# EAGLE design ATTint_SOMO-4D (EAGLE 6.1)
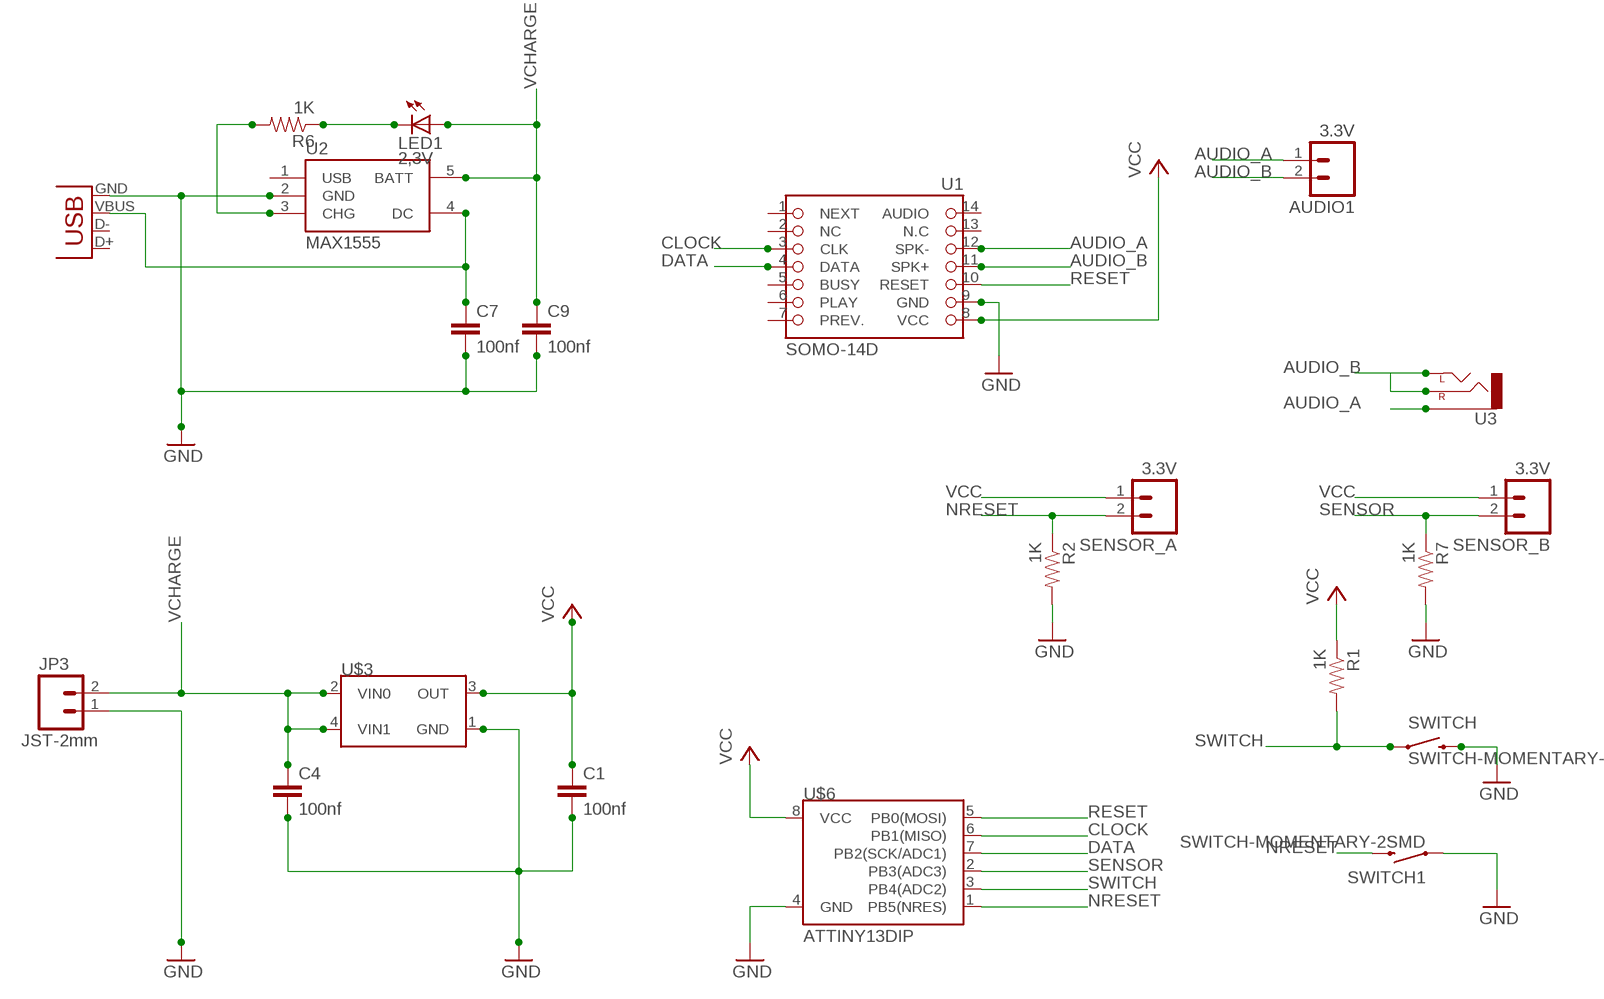
[diagram p0: schematic, sheet 1]

## Parts
AUDIO1  3.3V  M02LOCK_LONGPADS  [1X02_LOCK_LONGPADS]
C1  100nf  CAP0805  [0805]
C4  100nf  CAP0805  [0805]
C7  100nf  CAP0805  [0805]
C9  100nf  CAP0805  [0805]
JP3  JST-2mm  M02-JST-2MM-SMT  [JST-2-SMD]
LED1  2,3V  LEDCHIP-LED0805  [CHIP-LED0805]
R1  1K  RESISTOR  [0805]
R2  1K  RESISTOR  [0805]
R6  1K  RESISTOR  [0805]
R7  1K  RESISTOR  [0805]
SENSOR_A  3.3V  M02LOCK_LONGPADS  [1X02_LOCK_LONGPADS]
SENSOR_B  3.3V  M02LOCK_LONGPADS  [1X02_LOCK_LONGPADS]
SWITCH  SWITCH-MOMENTARY-2  [TACTILE_SWITCH_TALL]
SWITCH1  SWITCH-MOMENTARY-2SMD  [TACTILE_SWITCH_SMD]
U1  SOMO-14D  [SOMO-14D]
U2  MAX1555  [SOT23-5]
U3  AUDIO-JACKSMD2  [AUDIO-JACK-3.5MM-SMD]
U$3  MCP1703  [SOT-89]
U$6  ATTINY13DIP  [DIP08]
X3  USB-SMD-NS  [USB-MINIB-NOSTOP]

## Nets
AUDIO_A: AUDIO1.1 U1.12(SPK-) U3.SLEEVE
AUDIO_B: AUDIO1.2 U1.11(SPK+) U3.RING(RIGHT) U3.TIP(LEFT)
CLOCK: U1.3(CLK) U$6.6(PB1(MISO))
DATA: U1.4(DATA) U$6.7(PB2(SCK/ADC1))
GND [gnd_plane]: C1.2 C4.2 C7.2 C9.2 JP3.1 R2.2 R7.2 SWITCH1.1 SWITCH.B2 U1.9(GND) U2.2(GND) U$3.1(GND) U$6.4(GND) X3.GND
N$6: C7.1 U2.4(DC) X3.VBUS
N$7: R6.2 U2.3(CHG)
N$8: LED1.C R6.1
NRESET: R2.1 SENSOR_A.2 SWITCH1.3 U$6.1(PB5(NRES))
RESET: U1.10(RESET) U$6.5(PB0(MOSI))
SENSOR: R7.1 SENSOR_B.2 U$6.2(PB3(ADC3))
SWITCH: R1.2 SWITCH.A2 U$6.3(PB4(ADC2))
VCC [power]: C1.1 R1.1 SENSOR_A.1 SENSOR_B.1 U1.8(VCC) U$3.3(OUT) U$6.8(VCC)
VCHARGE [VDD]: C4.1 C9.1 JP3.2 LED1.A U2.5(BATT) U$3.2(VIN0) U$3.4(VIN1)
Unconnected: U1.1(NEXT) U1.2(NC) U1.5(BUSY) U1.6(PLAY) U1.7(PREV.) U1.13(N.C) U1.14(AUDIO) U2.1(USB) X3.D+ X3.D-

## Library data of the parts
AUDIO1 JP3 = SparkFun:M02: Header 2 Standard 2-pin 0.1" header. Use with straight break away headers (SKU : PRT-00116), right angle break away headers (PRT-00553), swiss pins (PRT-00743), machine pins (PRT-00117), and female headers (PRT-00115). Molex polarized connector foot print use with SKU : PRT-08233 with associated crimp pins and housings.
C1 C4 C7 C9 = spark-fun:CAP: Capacitor Standard 0603 ceramic capacitor, and 0.1" leaded capacitor.
LED1 = led:LED: LED OSRAM: - CHIPLED LG R971, LG N971, LY N971, LG Q971, LY Q971, LO R971, LY R971 LH N974, LH R974 LS Q976, LO Q976, LY Q976 LO Q996 - Hyper CHIPLED LW Q18S LB Q993, LB Q99A, LB R99A - SideLED LS A670, LO A670, LY A670, LG A670, LP A670 LB A673, LV A673, LT A673, LW A673 LH A674 LY A675 LS A676, LA A676, LO A676, LY A676, LW A676 LS A679, LY A679, LG A679 - Hyper Micro SIDELED® LS Y876, LA Y876, LO Y876, LY Y876 LT Y87S - SmartLED LW L88C, LW L88S LB L89C, LB L89S, LG L890 LS L89K, LO L89K, LY L89K LS L896, LA L896, LO L896, LY L896 - TOPLED LS T670, LO T670, LY T670, LG T670, LP T670 LSG T670, LSP T670, LSY T670, LOP T670, LYG T670 LG T671, LOG T671, LSG T671 LB T673, LV T673, LT T673, LW T673 LH T674 LS T676, LA T676, LO T676, LY T676, LB T676, LH T676, LSB T676, LW T676 LB T67C, LV T67C, LT T67C, LS T67K, LO T67K, LY T67K, LW E67C LS E67B, LA E67B, LO E67B, LY E67B, LB E67C, LV E67C, LT E67C LW T67C LS T679, LY T679, LG T679 LS T770, LO T770, LY T770, LG T770, LP T770 LB T773, LV T773, LT T773, LW T773 LH T774 LS E675, LA E675, LY E675, LS T675 LS T776, LA T776, LO T776, LY T776, LB T776 LHGB T686 LT T68C, LB T68C - Hyper Mini TOPLED® LB M676 - Mini TOPLED Santana® LG M470 LS M47K, LO M47K, LY M47K Source: http://www.osram.convergy.de LUXEON: - LUMILED® LXK2-PW12-R00, LXK2-PW12-S00, LXK2-PW14-U00, LXK2-PW14-V00 LXK2-PM12-R00, LXK2-PM12-S00, LXK2-PM14-U00 LXK2-PE12-Q00, LXK2-PE12-R00, LXK2-PE12-S00, LXK2-PE14-T00, LXK2-PE14-U00 LXK2-PB12-K00, LXK2-PB12-L00, LXK2-PB12-M00, LXK2-PB14-N00, LXK2-PB14-P00, LXK2-PB14-Q00 LXK2-PR12-L00, LXK2-PR12-M00, LXK2-PR14-Q00, LXK2-PR14-R00 LXK2-PD12-Q00, LXK2-PD12-R00, LXK2-PD12-S00 LXK2-PH12-R00, LXK2-PH12-S00 LXK2-PL12-P00, LXK2-PL12-Q00, LXK2-PL12-R00 Source: www.luxeon.com KINGBRIGHT: KA-3528ASYC Source: www.kingbright.com
R1 R2 R6 R7 = spark-fun:RESISTOR: Resistor Basic schematic elements and footprints for 0603, 1206, and PTH 1/10th watt (small) resistors.
SENSOR_A SENSOR_B = charles:M02: Header 2 Standard 2-pin 0.1" header. Use with straight break away headers (SKU : PRT-00116), right angle break away headers (PRT-00553), swiss pins (PRT-00743), machine pins (PRT-00117), and female headers (PRT-00115). Molex polarized connector foot print use with SKU : PRT-08233 with associated crimp pins and housings.
SWITCH SWITCH1 = SparkFun:SWITCH-MOMENTARY-2
U1 = SpaElectronics:SOMO-14D: SOMO-14D This library allows the mounting of the SOMO-14D to a circuit board, either via female headers (Recomended), or direct soldering (Not Recomended). http://www.4dsystems.com.au/prod.php?id=73
U2 = spark-fun:MAX1555: MAX1555 Lithium Charger IC SOT-23 Lithium Polymer charging IC. Schematic element and footprint proven. Spark Fun Electronics SKU : COM-00674
U3 = SparkFun:AUDIO-JACK: 3.5mm Audio Jack Simple 3.5mm common PCB mount audio jack. SKU: PRT-08032
U$3 = MCP1703:MCP1703
U$6 = SparkFun:ATTINY13
X3 = SparkFun:USB: USB Connectors USB-B-PTH is fully proven SKU : PRT-00139 USB-miniB is fully proven SKU : PRT-00587 USB-A-PCB is untested. USB-A-H is throughly reviewed, but untested. Spark Fun Electronics SKU : PRT-00437 USB-B-SMT is throughly reviewed, but untested. Needs silkscreen touching up. USB-A-S has not been used/tested USB-MB-H has not been used/tested

## Net classes
1 power: width 0.203 mm
2 gnd_plane: width 2 mm, drill 0.8 mm, clearance 0.432 mm
4 VDD: width 1 mm, clearance 0.381 mm

## Board
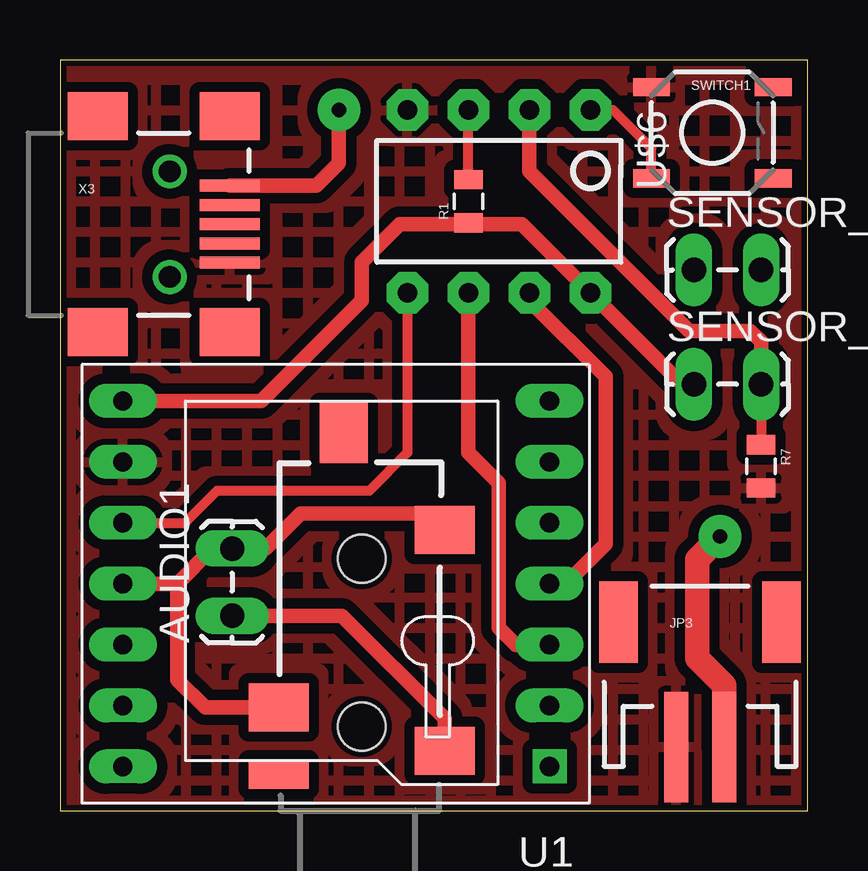
[diagram p1: board, top side]
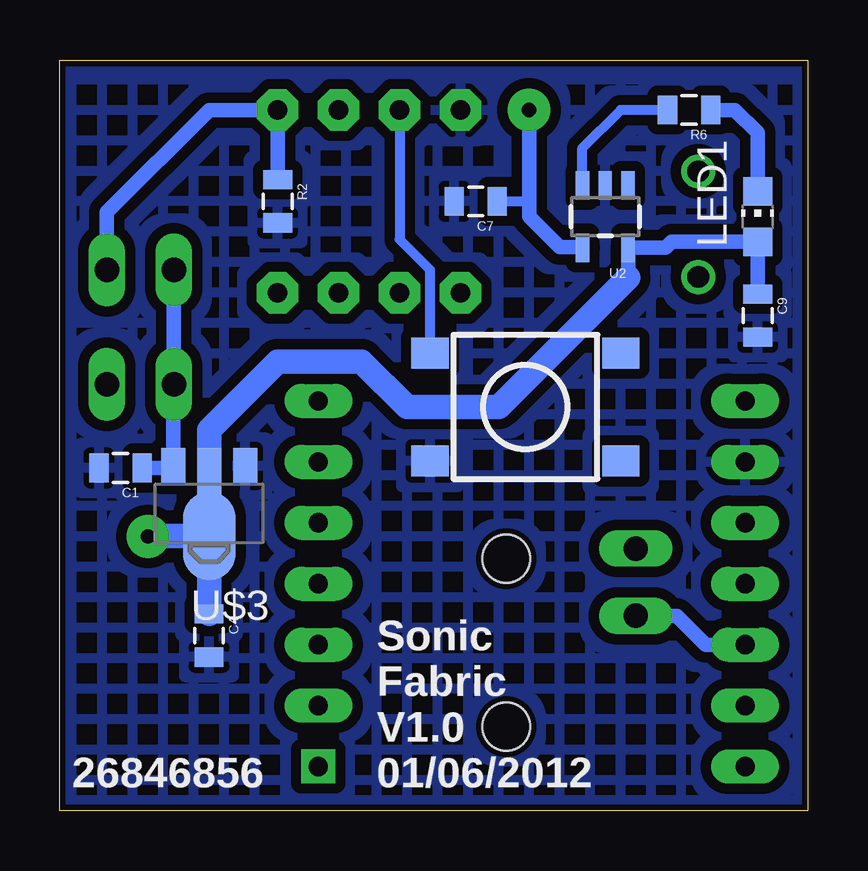
[diagram p2: board, bottom side, seen from below]

Size 31.17 x 31.3 mm. Coordinates in mm from the lower left corner, seen from the top.
Outline: 0,0 31.17,0 31.17,31.3 0,31.3 0,0
Copper layers (1*16): Top 0.035mm / dielectric 1.5mm / Bottom 0.035mm
Design rules: minimum track width 6mil, minimum drill 12mil, track to track 6mil, track to pad 6mil, pad to pad 6mil, via to via 6mil, smd to smd 0mil, copper to edge 10mil, drill to drill 10mil, minimum pad ring 10mil, minimum via ring 6mil, stop-mask expansion 2mil, vias tented up to drill 100mil, thermal gap 10mil

### Footprints (pad centres in the part's own frame; a part is rotated, then mirrored left to right if it is on the bottom)
1X02_LOCK_LONGPADS = drill 1.016 long: 1 -0.127,0; 2 2.667,0
0805 = smd 0.8 x 1.2: 1 -0.9,0; 2 0.9,0
JST-2-SMD = smd 1 x 4.6: 1 -1,-3.7; 2 1,-3.7 | smd 1.6 x 3.4: NC1 -3.4,1.5; NC2 3.4,1.5
CHIP-LED0805 = smd 1.2 x 1.2: A 0,-1.05; C 0,1.05
TACTILE_SWITCH_TALL = smd 1.55 x 1.3: A1 -3.975,-2.25; A2 3.975,-2.25; B1 -3.975,2.25; B2 3.975,2.25
TACTILE_SWITCH_SMD = smd 1.524 x 0.762: 1 -2.54,1.905; 2 2.54,1.905; 3 -2.54,-1.905; 4 2.54,-1.905
SOMO-14D = drill 0.8 pad 1.422 square: 1 -9.16,7.24 | drill 0.8 pad 1.422 long: 2 -9.16,4.7; 3 -9.16,2.16; 4 -9.16,-0.38; 5 -9.16,-2.92; 6 -9.16,-5.46; 7 -9.16,-8; 8 8.62,-8; 9 8.62,-5.46; 10 8.62,-2.92; 11 8.62,-0.38; 12 8.62,2.16; 13 8.62,4.7; 14 8.62,7.24
SOT23-5 = smd 0.55 x 1.2: 1 -0.95,-1.3; 2 0,-1.3; 3 0.95,-1.3; 4 0.95,1.3; 5 -0.95,1.3
AUDIO-JACK-3.5MM-SMD = smd 2 x 2.5: RING 4.3,3.45; SLEEVE 2.5,-3.45; TIP 11.7,-3.45 | smd 1.2 x 2.5: RSH 1.5,3.45 | smd 2.5 x 2: TSH 15.75,0.75 | hole 2: 3.5,0; 10.5,0
SOT-89 = smd 1 x 1.5: 1 -1.499,-1.981; 3 1.499,-1.981 | smd 1 x 2: 2 0,-1.727 | smd 2.2 x 3.7: 4 0,0.94
DIP08 = drill 0.813 pad 1.727 octagon: 1 -3.81,-3.81; 2 -1.27,-3.81; 3 1.27,-3.81; 4 3.81,-3.81; 5 3.81,3.81; 6 1.27,3.81; 7 -1.27,3.81; 8 -3.81,3.81
USB-MINIB-NOSTOP = smd 2.5 x 0.5: D+ 2.5,0; D- 2.5,0.8; GND 2.5,-1.6; ID 2.5,-0.8; VBUS 2.5,1.6 | smd 2.5 x 2: G1 -3,-4.5; G2 -3,4.5; G3 2.5,4.5; G4 2.5,-4.5 | drill 0.9 pad 0.8: H1 0,2.2 | drill 0.9 pad 0.787: H2 0,-2.2

### Placement (x,y rotation side)
AUDIO1  7.18,8.26 90 top
C1  28.64,14.29 180 bottom
C4  24.96,7.3 270 bottom
C7  13.84,25.4 180 bottom
C9  2.1,20.64 270 bottom
JP3  26.67,6.35 0 top
LED1  2.1,24.77 0 bottom
R1  17.02,25.4 90 top
R2  22.1,25.4 270 bottom
R6  4.95,29.21 180 bottom
R7  29.21,14.35 270 top
SENSOR_A  26.54,22.54 0 top
SENSOR_B  26.54,17.78 0 top
SWITCH  11.77,16.83 180 bottom
SWITCH1  27.18,28.26 0 top
U1  11.24,9.08 180 top
U2  8.45,24.77 180 bottom
U3  12.57,0 90 top
U$3  24.96,12.38 180 bottom
U$6  18.29,25.4 180 top
X3  4.57,24.45 0 top

### Tracks (layer width: path | path; a pad name or v marks a point on that pad's centre or on a via)
AUDIO_A
  Top 0.61: AUDIO1.1 11.75,8.13 16.02,3.85 U3.SLEEVE
  Bottom 0.61: AUDIO1.1 5.46,8.13 4.25,6.92 U1.12
AUDIO_B
  Top 0.61: U1.11 4.89,9.46 | U3.TIP 15.34,12.38 10.03,12.38 8.57,10.92 AUDIO1.2 6.35,10.92 4.89,9.46 | 4.89,9.46 4.89,5.46 6.05,4.3 U3.RING
CLOCK
  Top 0.61: U$6.6 17.02,14.92 18.29,13.65 18.29,7.62 18.99,6.92 U1.3
DATA
  Top 0.61: U$6.7 19.56,21.27 22.73,18.1 22.73,11.11 21.08,9.46 U1.4
GND
  pour Bottom (hatched): 0,31.31 31.18,31.31 31.18,0 0,0
  pour Top (hatched): 0,31.31 31.18,31.31 31.18,0 0,0
N$6  (via drill 0.6 pad 1.78)
  Top 0.61: X3.VBUS 10.68,26.05 11.62,26.99 v11.62,29.21
  Bottom 0.406: C7.1 11.62,25.4
  Bottom 0.61: v11.62,29.21 11.62,25.4 11.62,24.77 10.35,23.5 9.43,23.5 U2.4
N$7
  Bottom 0.406: U2.3 9.4,27.62 7.81,29.21 R6.2
N$8
  Bottom 0.61: R6.1 3.05,29.21 2.1,28.26 LED1.C
NRESET
  Top 0.406: U$6.1 23.05,29.21 24.64,27.62 SWITCH1.3
  Bottom 0.61: SENSOR_A.2 29.21,24.96 24.96,29.21 U$6.1 R2.1
RESET
  Top 0.406: U$6.5 14.48,14.92 12.89,13.34 6.54,13.34 5.21,12 U1.10
SENSOR
  Top 0.406: SENSOR_B.2 R7.1
  Top 0.61: SENSOR_B.2 29.21,19.56 28.77,20 26.23,20 19.56,26.67 U$6.2
SWITCH
  Top 0.406: R1.2 U$6.3
  Bottom 0.406: U$6.3 17.02,23.81 15.75,22.54 SWITCH.A2
VCC
  Top 0.406: R1.1 16.75,24.5 16.7,24.45
  Top 0.61: SENSOR_B.1 25.91,17.78 U$6.8 19.24,24.45 16.7,24.45 14.16,24.45 12.57,22.86 12.57,21.27 8.38,17.08 U1.8
  Bottom 0.61: C1.1 26.53,14.29 U$3.3 26.45,17.37 26.73,17.65 SENSOR_B.1 SENSOR_A.1
VCHARGE  (via drill 0.6 pad 1.78)
  Top 1.016: v27.5,11.43 26.54,10.48 26.54,6.35 27.67,5.22 JP3.2
  Bottom 0.61: C9.1 LED1.A 5.69,23.71 5.94,23.46 U2.5 7.5,22.22
  Bottom 1.016: 7.5,22.22 12.89,16.83 16.7,16.83 18.61,18.73 22.1,18.73 24.96,15.88 U$3.2 U$3.4 | U$3.4 27.48,11.44 v27.5,11.43 | C4.1 U$3.4

### Text on the board
_bsilk: Sonic | Fabric | V1.0 | 01/06/2012 | 26846856